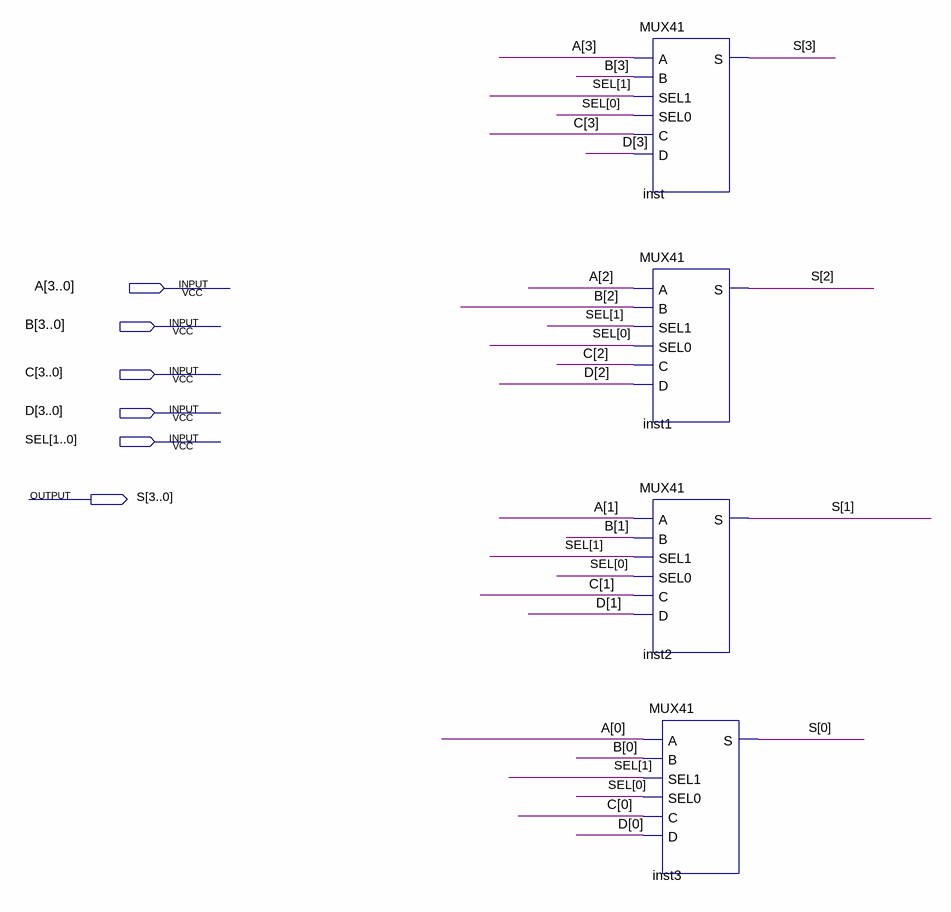
[diagram p0: schematic sheet]
// Quartus schematic MUX41_4BITS.bdf as structural Verilog: 4 symbols, 6 pins
module MUX41_4BITS (
  input  [3:0] A,
  input  [3:0] B,
  input  [3:0] C,
  input  [3:0] D,
  input  [1:0] SEL,
  output [3:0] S
);

  MUX41 inst (.A(A[3]), .B(B[3]), .SEL1(SEL[1]), .SEL0(SEL[0]), .C(C[3]), .D(D[3]), .S(S[3]));
  MUX41 inst1 (.A(A[2]), .B(B[2]), .SEL1(SEL[1]), .SEL0(SEL[0]), .C(C[2]), .D(D[2]), .S(S[2]));
  MUX41 inst2 (.A(A[1]), .B(B[1]), .SEL1(SEL[1]), .SEL0(SEL[0]), .C(C[1]), .D(D[1]), .S(S[1]));
  MUX41 inst3 (.A(A[0]), .B(B[0]), .SEL1(SEL[1]), .SEL0(SEL[0]), .C(C[0]), .D(D[0]), .S(S[0]));
endmodule
